# Altium schematic sheet Output_Register.SchDoc
size B; Author: E. Sims; Organization: Let's Build Rockets Inc.; SheetNumber: 8; SheetTotal: 16
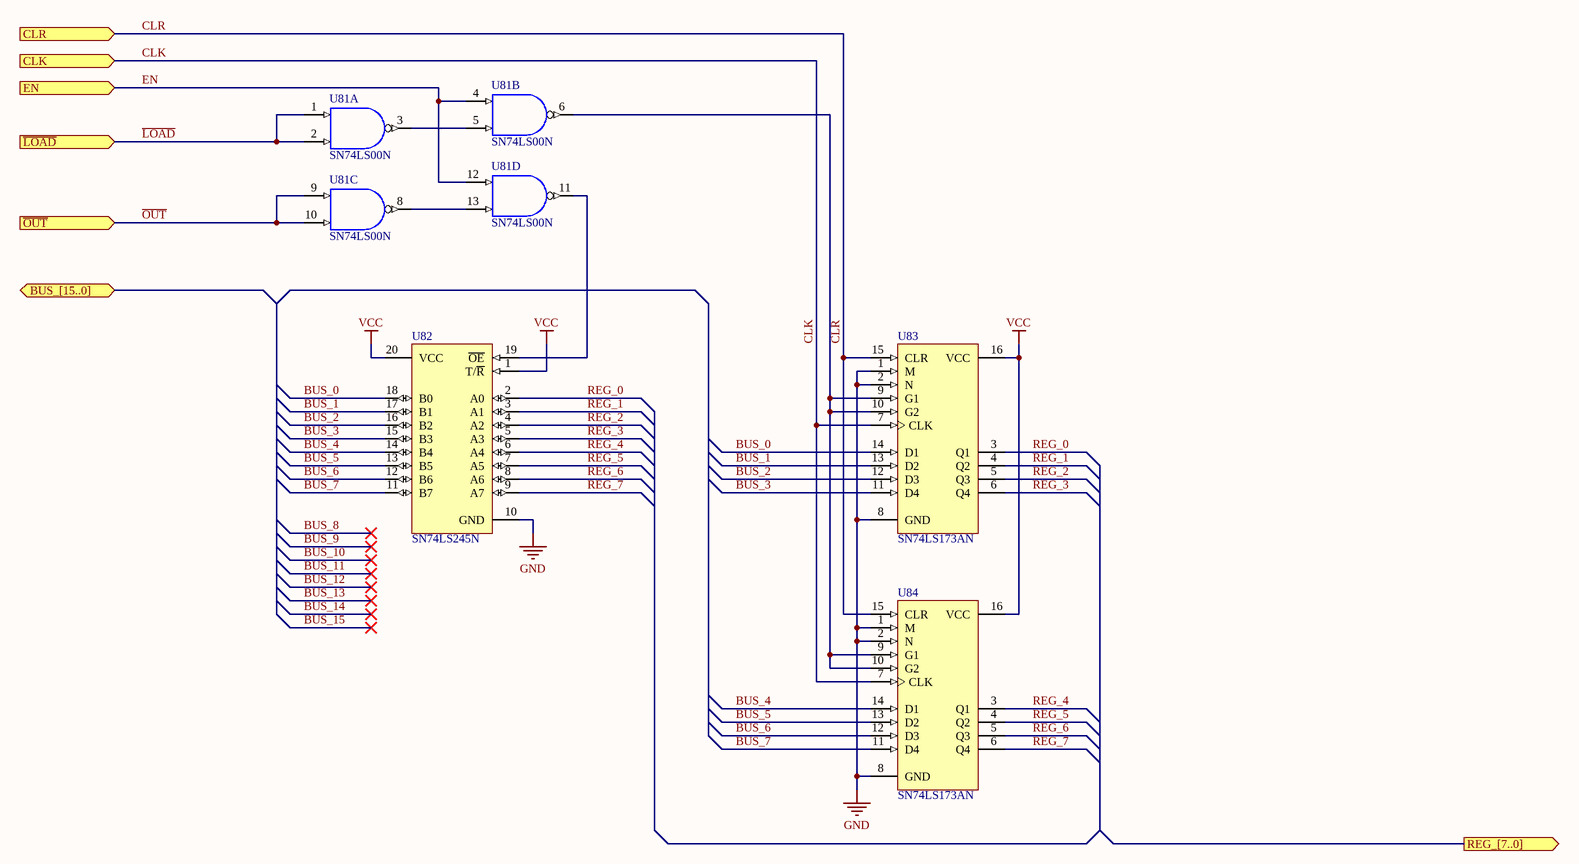
[diagram p0: Output_Register.SchDoc]

## Parts
U81  SN74LS00N  [N014]  (parts A,B,C,D of 4)
U82  SN74LS245N  [N020]
U83  SN74LS173AN  [N016D]
U84  SN74LS173AN  [N016D]

## Ports
BUS_[15..0] (bidir), CLK (in), CLR (in), EN (in), REG_[7..0] (out), ~{LOAD} (in), ~{OUT} (in)

## Nets
GND: U81.7(GND) U82.10(GND) U83.1(M) U83.2(N) U83.8(GND) U84.1(M) U84.2(N) U84.8(GND)
VCC: U81.14(VCC) U82.1(T/~{R}) U82.20(VCC) U83.16(VCC) U84.16(VCC)
BUS_0: U82.18(B0) U83.14(D1)
BUS_1: U82.17(B1) U83.13(D2)
BUS_2: U82.16(B2) U83.12(D3)
BUS_3: U82.15(B3) U83.11(D4)
BUS_4: U82.14(B4) U84.14(D1)
BUS_5: U82.13(B5) U84.13(D2)
BUS_6: U82.12(B6) U84.12(D3)
BUS_7: U82.11(B7) U84.11(D4)
CLK: U83.7(CLK) U84.7(CLK) ; port CLK
CLR: U83.15(CLR) U84.15(CLR) ; port CLR
EN: U81.4(A) U81.12(A) ; port EN
~{LOAD}: U81.1(A) U81.2(B) ; port ~{LOAD}
~{OUT}: U81.9(A) U81.10(B) ; port ~{OUT}
REG_0: U82.2(A0) U83.3(Q1)
REG_1: U82.3(A1) U83.4(Q2)
REG_2: U82.4(A2) U83.5(Q3)
REG_3: U82.5(A3) U83.6(Q4)
REG_4: U82.6(A4) U84.3(Q1)
REG_5: U82.7(A5) U84.4(Q2)
REG_6: U82.8(A6) U84.5(Q3)
REG_7: U82.9(A7) U84.6(Q4)
NetU81_3: U81.3(Y) U81.5(B)
NetU81_6: U81.6(Y) U83.9(G1) U83.10(G2) U84.9(G1) U84.10(G2)
NetU81_8: U81.8(Y) U81.13(B)
NetU81_11: U81.11(Y) U82.19(~{OE})

## Notes on the sheet
- Let's Build Rocket's Inc. Modular Paylaod System Based on TMP-010 Rev
  For more information visit https://github.com/LetsBuildRockets/Modular-Payload-System
  This work is licensed under CC BY-NC 4.0. To view a copy of this license, visit https://creativecommons.org/licenses/by-nc/4.0
- Title
- Size:
- Date:
- Assembly Variant:
- B
- Number:
- Time:
- Revision:
- Sheet
- of
- Author:
- File:

## Library data of the parts
U81 = SN74LS00N: Quadruple 2-Input Positive-NAND Gate; Published: 8-Jun-2000; LatestRevisionDate: 04-Mar-2005; LatestRevisionNote: Stylized 3D Model Added.; DatasheetVersion: Mar-1988; PackageVersion: Oct-1995; PackageReference: N014; Publisher: Altium Limited; PackageDescription: DIP; 14 Leads; Row Spacing 7.62 mm; Pitch 2.54 mm; ComponentLink1Description: Manufacturer Link; ComponentLink1URL: http://www.ti.com/; ComponentLink2Description: Datasheet; ComponentLink2URL: http://www-s.ti.com/sc/ds/sn74ls00.pdf
U82 = SN74LS245N: Octal Bus Transceiver with 3-State Outputs; Published: 8-Jun-2000; LatestRevisionDate: 04-Mar-2005; LatestRevisionNote: Stylized 3D Model Added.; DatasheetVersion: Mar-1988; PackageVersion: Oct-1995; PackageReference: N020; Publisher: Altium Limited; PackageDescription: DIP; 20 Leads; Row Spacing 7.62 mm; Pitch 2.54 mm; ComponentLink1Description: Manufacturer Link; ComponentLink1URL: http://www.ti.com/; ComponentLink2Description: Datasheet; ComponentLink2URL: http://www-s.ti.com/sc/ds/sn74ls245.pdf
U83 U84 = SN74LS173AN: 4-Bit D-Type Register with 3-State Outputs; Published: 8-Jun-2000; LatestRevisionDate: 04-Mar-2005; LatestRevisionNote: Stylized 3D Model Added.; DatasheetVersion: Mar-1988; PackageVersion: Oct-1995; PackageReference: N016D; Publisher: Altium Limited; PackageDescription: DIP; 16 Leads; Row Spacing 7.62 mm; Pitch 2.54 mm; Code_JEDEC: MS-001-BB; ComponentLink1Description: Manufacturer Link; ComponentLink1URL: http://www.ti.com/; ComponentLink2Description: Datasheet; ComponentLink2URL: http://www-s.ti.com/sc/ds/sn74ls173a.pdf